# EAGLE schematic Schematic (EAGLE 7.3.0)
Datalogger with OneWire port and 6 anaog ports on flat connector.
CNAME: Per Abich / Visma Consulting AS
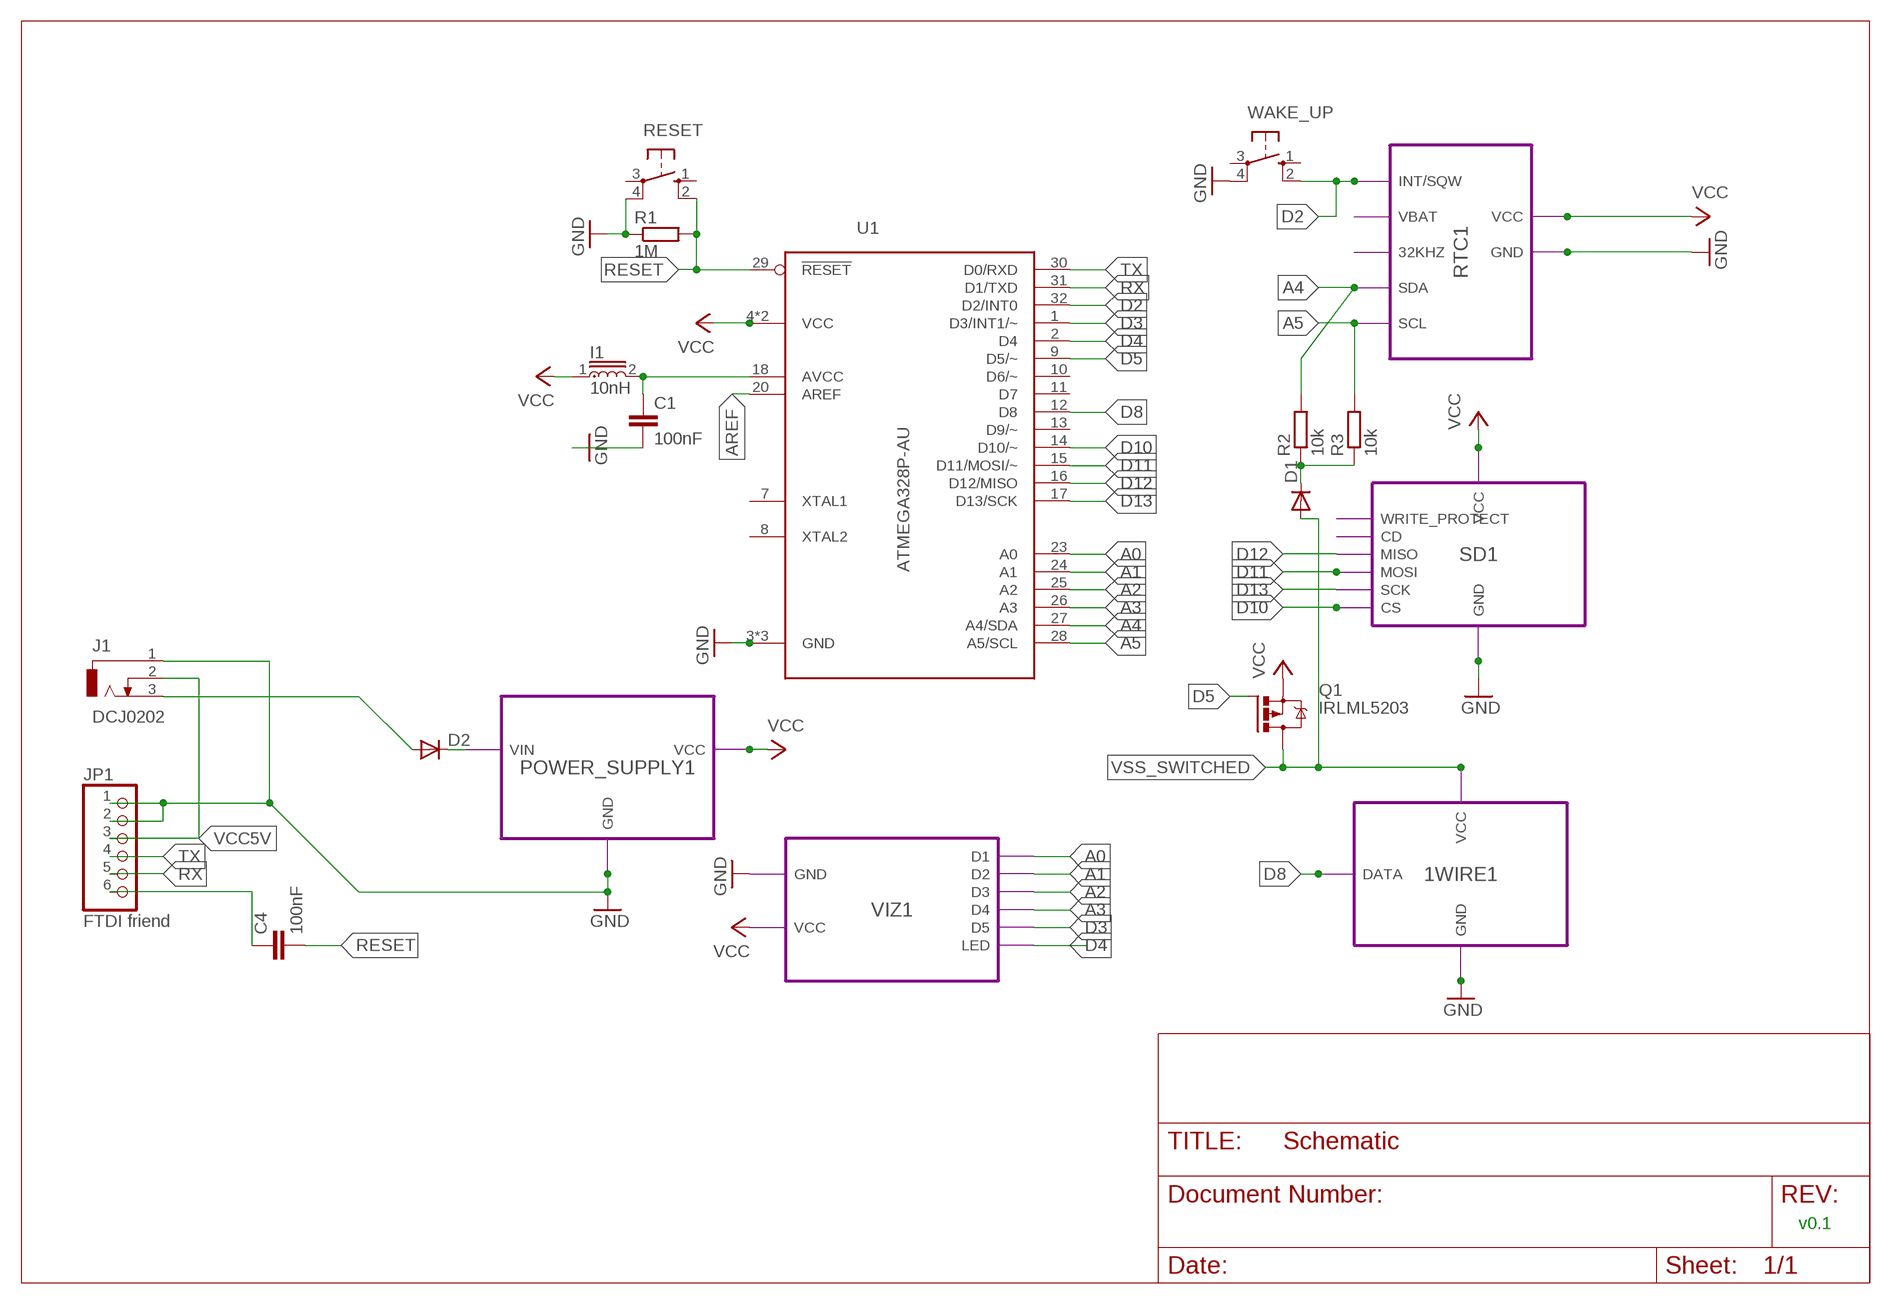
[diagram p0: schematic, sheet 1]

## Parts
C1  100nF  C-EUC1206  [C1206]
C4  100nF  C-EUC1206  [C1206]
D1  DIODE-DO214AA  [DO214AA]
D2  DIODE-DO214AA  [DO214AA]
I1  10nH  MLF1608E  [L3225M]
J1  DCJ0202  [DCJ0202]
JP1  FTDI friend  PINHD-1X6/90  [1X06/90]
Q1  IRLML5203  [MICRO3]
R1  1M  R-EU_R1206  [R1206]
R2  10k  R-EU_R1206  [R1206]
R3  10k  R-EU_R1206  [R1206]
RESET  10-XX  [B3F-10XX]
U1  ATMEGA328P-AU  [TQFP32-08]
WAKE_UP  10-XX  [B3F-10XX]

## Module instances
POWER_SUPPLY1 = POWER_SUPPLY
RTC1 = RTC
SD1 = SDCARD
1WIRE1 = ONE_WIRE
VIZ1 = VISIBILITY_SENSOR

## Nets
A0: U1.23(A0) ; port VIZ1.D1
A1: U1.24(A1) ; port VIZ1.D2
A2: U1.25(A2) ; port VIZ1.D3
A3: U1.26(A3) ; port VIZ1.D4
A4: R2.2 U1.27(A4/SDA) ; port RTC1.SDA
A5: R3.2 U1.28(A5/SCL) ; port RTC1.SCL
AREF: U1.20(AREF)
AVCC: C1.1 I1.2 U1.18(AVCC)
D2: U1.32(D2/INT0) WAKE_UP.2(S1) ; port RTC1.INT/SQW
D3: U1.1(D3/INT1/~) ; port VIZ1.D5
D4: U1.2(D4) ; port VIZ1.LED
D5: Q1.1(G) U1.9(D5/~)
D8: U1.12(D8) ; port 1WIRE1.DATA
D10: U1.14(D10/~) ; port SD1.CS
D11: U1.15(D11/MOSI/~) ; port SD1.MOSI
D12: U1.16(D12/MISO) ; port SD1.MISO
D13: U1.17(D13/SCK) ; port SD1.SCK
DTR: C4.1 JP1.6
GND: C1.2 J1.1 JP1.1 JP1.2 R1.1 RESET.4(P1) U1.3(GND) U1.5(GND) U1.21(GND) WAKE_UP.4(P1) ; port POWER_SUPPLY1.GND RTC1.GND SD1.GND 1WIRE1.GND VIZ1.GND
N$1: D2.A J1.3
N$2: D2.C ; port POWER_SUPPLY1.VIN
N$17: D1.C R2.1 R3.1
RESET: C4.2 R1.2 RESET.2(S1) U1.29(!RESET)
RX: JP1.5 U1.31(D1/TXD)
TX: JP1.4 U1.30(D0/RXD)
VCC: I1.1 Q1.2(S) U1.4(VCC) U1.6(VCC) ; port POWER_SUPPLY1.VCC RTC1.VCC SD1.VCC VIZ1.VCC
VCC5V: J1.2 JP1.3
VSS_SWITCHED: D1.A Q1.3(D) ; port 1WIRE1.VCC
Unconnected: RESET.1(S) RESET.3(P) U1.7(XTAL1) U1.8(XTAL2) U1.10(D6/~) U1.11(D7) U1.13(D9/~) WAKE_UP.1(S) WAKE_UP.3(P)

## Notes on the sheet
- v0.1

## Library data of the parts
C1 C4 = rcl:C-EU: CAPACITOR, European symbol; MF: AVX; MPN: 02016D104KAT2A; OC_FARNELL: 2280755
D1 D2 = diode:DIODE-: DIODE; OC_FARNELL: unknown
I1 = Element14Parts:MLF1608E; MF: TDK; MPN: NLCV32T-100K-PFR; OC_FARNELL: 2112810
J1 = con-jack:DCJ0202: DC POWER JACK Source: DCJ0202.pdf; OC_FARNELL: unknown; OC_NEWARK: unknown
JP1 = pinhead:PINHD-1X6: PIN HEADER; OC_FARNELL: unknown; VV: v,,v
Q1 = transistor-power:IRLML5203: HEXFET P-Channel Power MOSFET; MF: FAIRCHILD SEMICONDUCTOR; MPN: FDN360P; OC_FARNELL: 9846336
R1 = rcl:R-EU_: RESISTOR, European symbol; MF: VISHAY DRALORIC; MPN: CRCW12061M00FKEA; OC_FARNELL: 1469968
R2 R3 = rcl:R-EU_: RESISTOR, European symbol; MF: VISHAY DRALORIC; MPN: CRCW120610K0FKTA; OC_FARNELL: 1653050
RESET WAKE_UP = switch-omron:10-XX: OMRON SWITCH; MF: OMRON ELECTRONIC COMPONENTS; MPN: B3F-1000; OC_FARNELL: 176432; OC_NEWARK: 36M3542
U1 = Arduino Dev Parts:ATMEGA328P: Atmel ATmega328P; MPN: ATMEGA328P-AU; OC_FARNELL: 1715486; OC_NEWARK: 68T2935

## Module POWER_SUPPLY
Ports: VCC(io) VIN(io) GND(io)
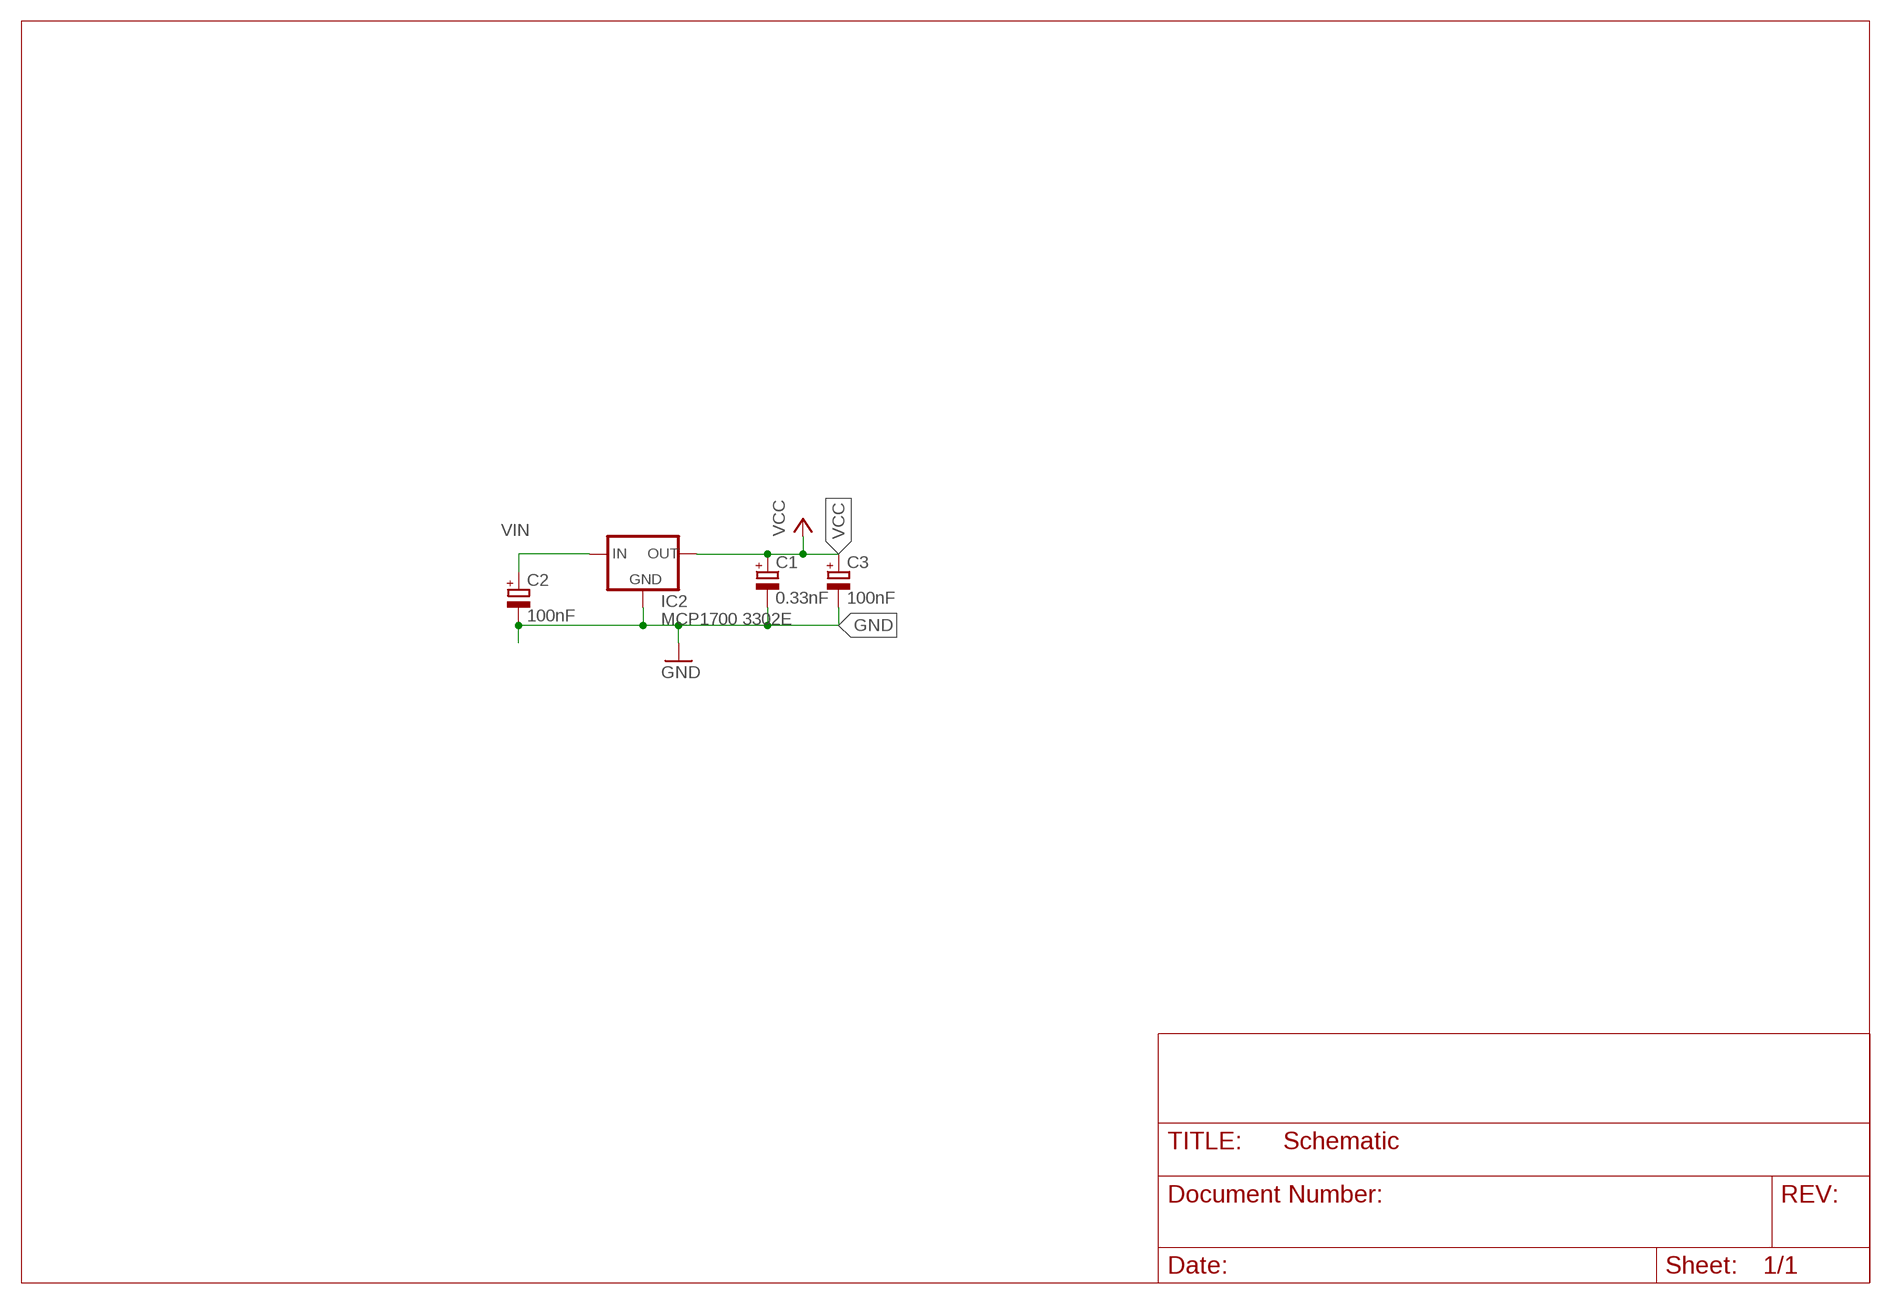
[diagram p1: schematic, module POWER_SUPPLY, sheet 1]

### Parts
C1  0.33nF  CPOL-EUSMCB  [SMC_B]
C2  100nF  CPOL-EUSMCB  [SMC_B]
C3  100nF  CPOL-EUSMCB  [SMC_B]
IC2  MCP1700 3302E  MCP1700INLINE  [TO92-INLINE]

### Nets
GND: C1.- C2.- C3.- IC2.1(GND)
VCC: C1.+ C3.+ IC2.3(OUT)
VIN: C2.+ IC2.2(IN)

### Library data of the parts
C1 = rcl:CPOL-EU: POLARIZED CAPACITOR, European symbol; MF: AVX; MPN: 0201YC331KAT2A; OC_FARNELL: 1327618RL
C2 C3 = rcl:CPOL-EU: POLARIZED CAPACITOR, European symbol; MF: AVX; MPN: 02016D104KAT2A; OC_FARNELL: 2280755
IC2 = adafruit:MCP1700: VOLTAGE REGULATOR; MF: MICROCHIP; MPN: MCP1700-3302E/TO; OC_FARNELL: 1296588

## Module RTC
Ports: GND(io) VCC(io) SCL(io) SDA(io) 32KHZ(io) INT/SQW(io) VBAT(io)
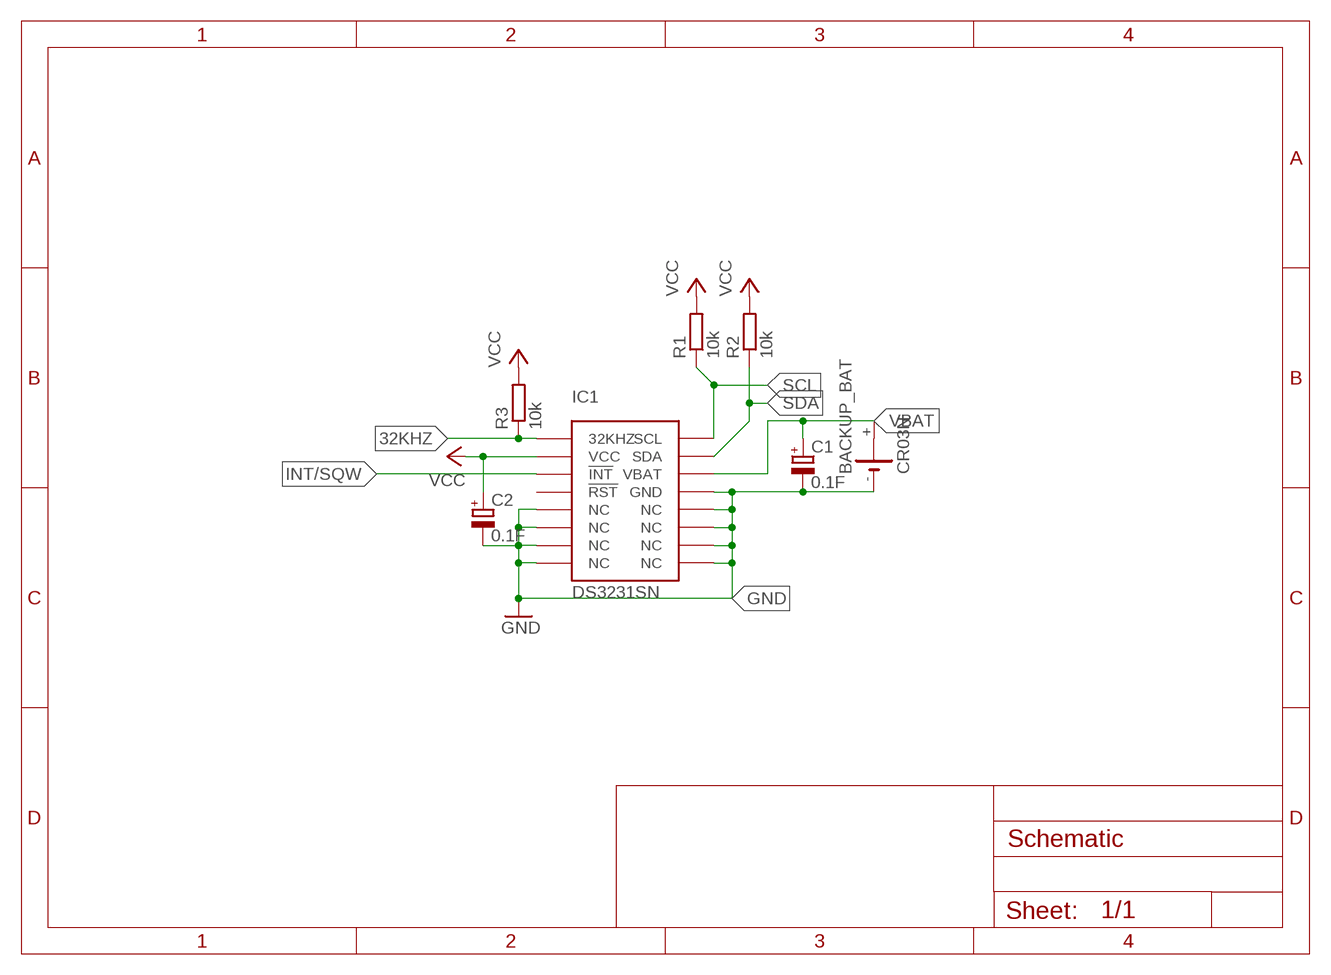
[diagram p2: schematic, module RTC, sheet 1]

### Parts
BACKUP_BAT  CR03N  [CR03N]
C1  0.1F  CPOL-EUSMCB  [SMC_B]
C2  0.1F  CPOL-EUSMCB  [SMC_B]
IC1  DS3231SN  DS3231SOIC-16W  [SOIC-16W]
R1  10k  R-EU_R1206  [R1206]
R2  10k  R-EU_R1206  [R1206]
R3  10k  R-EU_R1206  [R1206]

### Nets
32KHZ: IC1.1(32KHZ) R3.1
GND: BACKUP_BAT.- C1.- C2.- IC1.5(NC) IC1.6(NC) IC1.7(NC) IC1.8(NC) IC1.9(NC) IC1.10(NC) IC1.11(NC) IC1.12(NC) IC1.13(GND)
INT/SQW: IC1.3(!INT)
SCL: IC1.16(SCL) R1.1
SDA: IC1.15(SDA) R2.1
VBAT: BACKUP_BAT.+ C1.+ IC1.14(VBAT)
VCC: C2.+ IC1.2(VCC) R1.2 R2.2 R3.2
Unconnected: BACKUP_BAT.+@1(+) IC1.4(!RST)

### Library data of the parts
BACKUP_BAT = battery:CR03N: LI BATTERY Sonnenschein; OC_FARNELL: unknown
C1 C2 = rcl:CPOL-EU: POLARIZED CAPACITOR, European symbol; MF: AVX; MPN: TAJB107K004RNJ; OC_FARNELL: 196988
IC1 = DS3231_industrialberry:DS3231; MF: MAXIM INTEGRATED PRODUCTS; MPN: DS3231SN#; OC_FARNELL: 1593292
R1-R3 = rcl:R-EU_: RESISTOR, European symbol; MF: VISHAY DRALORIC; MPN: CRCW120610K0FKTA; OC_FARNELL: 1653050

## Module SDCARD
Ports: VCC(io) GND(io) WRITE_PROTECT(io) CD(io) MISO(io) MOSI(io) SCK(io) CS(io)
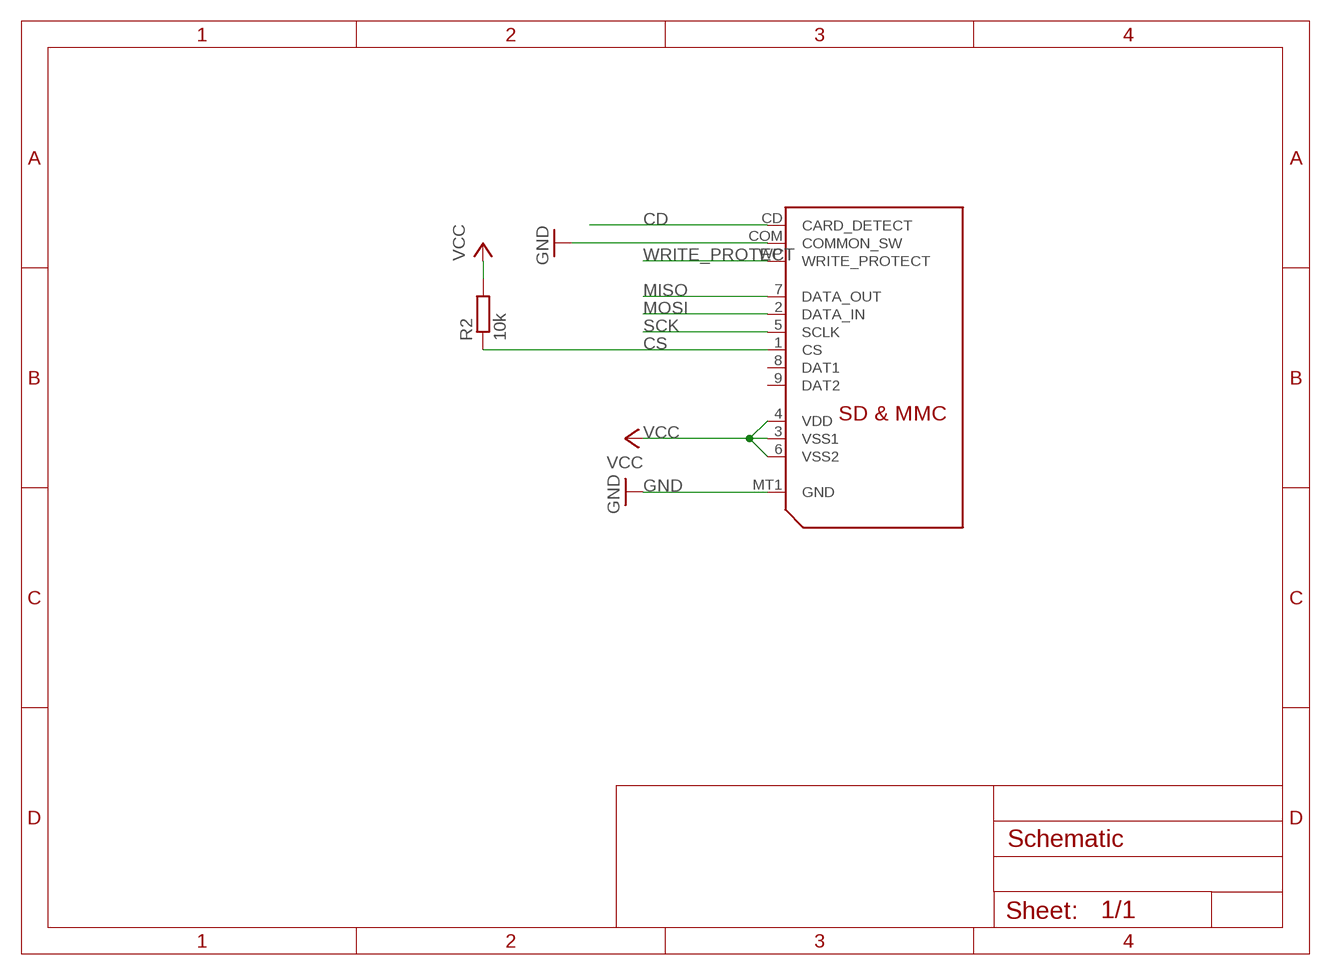
[diagram p3: schematic, module SDCARD, sheet 1]

### Parts
R2  10k  R-EU_R1206  [R1206]
U$1  SDMMC18650  [SDCARD]

### Nets
CD: U$1.CD(CARD_DETECT)
CS: R2.1 U$1.1(CS)
GND: U$1.COM(COMMON_SW) U$1.MT1(GND)
MISO: U$1.7(DATA_OUT)
MOSI: U$1.2(DATA_IN)
SCK: U$1.5(SCLK)
VCC: R2.2 U$1.3(VSS1) U$1.4(VDD) U$1.6(VSS2)
WRITE_PROTECT: U$1.WP(WRITE_PROTECT)
Unconnected: U$1.8(DAT1) U$1.9(DAT2)

### Library data of the parts
R2 = rcl:R-EU_: RESISTOR, European symbol; MF: VISHAY DRALORIC; MPN: CRCW120610K0FKTA; OC_FARNELL: 1653050
U$1 = adafruit:SDMMC: SD MMC Card holder 4UCON part #06132 - easy to solder; MF: AMPHENOL COMMERCIAL PRODUCTS; MPN: 101-00565-64; OC_FARNELL: 2135992

## Module ONE_WIRE
Ports: VCC(io) DATA(io) GND(io)
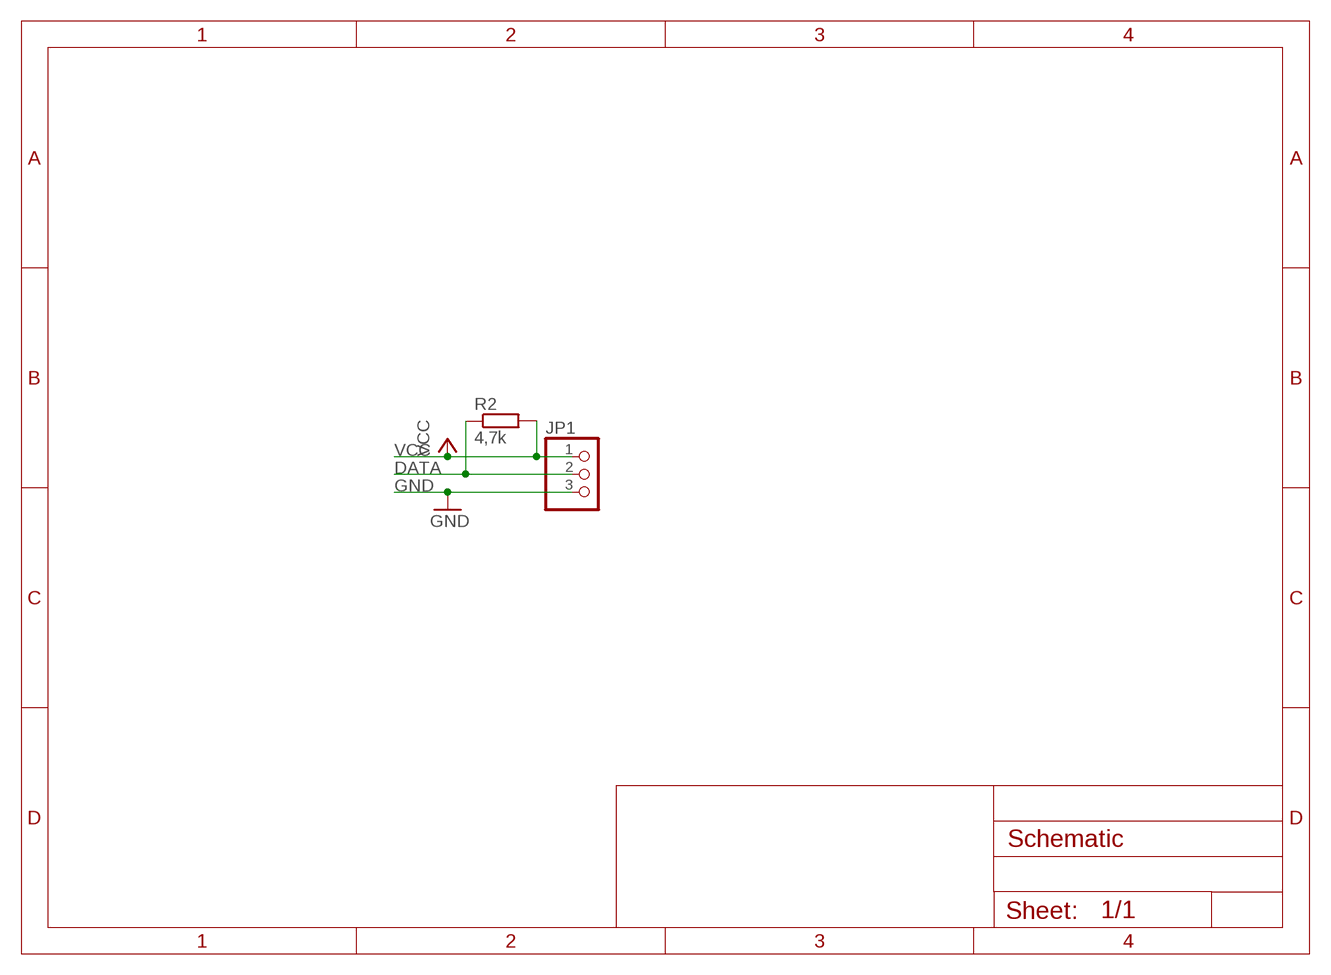
[diagram p4: schematic, module ONE_WIRE, sheet 1]

### Parts
JP1  PINHD-1X3/90  [1X03/90]
R2  4,7k  R-EU_R1206  [R1206]

### Nets
DATA: JP1.2 R2.1
GND: JP1.3
VCC: JP1.1 R2.2

### Library data of the parts
JP1 = pinhead:PINHD-1X3: PIN HEADER; MF: TE CONNECTIVITY / AMP; MPN: 292253-3; OC_FARNELL: 1282936
R2 = resistor:R-EU_: RESISTOR, European symbol; MF: PANASONIC ELECTRONIC COMPONENTS; MPN: ERJB1AF472U; OC_FARNELL: 2293982RL

## Module VISIBILITY_SENSOR
Ports: GND(io) VCC(io) D1(io) D2(io) D3(io) D4(io) D5(io) LED(io)
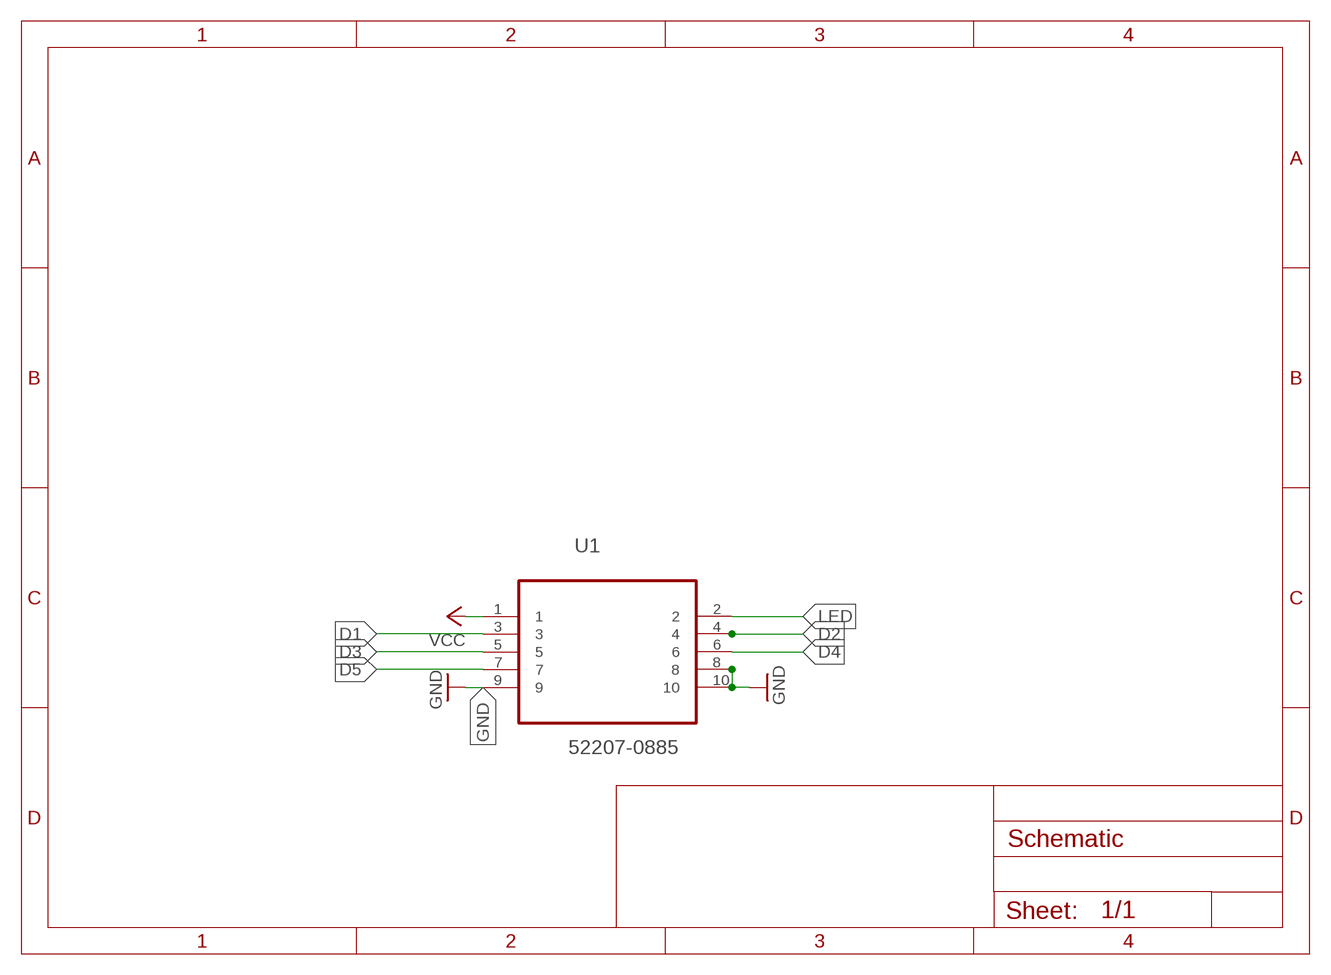
[diagram p5: schematic, module VISIBILITY_SENSOR, sheet 1]

### Parts
U1  52207-0885  [MOLEX_52207-0885]

### Nets
D1: U1.3
D2: U1.4
D3: U1.5
D4: U1.6
D5: U1.7
GND: U1.8 U1.9 U1.10
LED: U1.2
VCC: U1.1

### Library data of the parts
U1 = Molex_By_element14_Batch_1:52207-0885: SOCKET FPC, SMT, 1MM, 8 WAY; OC_FARNELL: unknown; OC_NEWARK: 07P8553; PACKAGE: SOCKET FPC, SMT, 1MM, 8 WAY; SUPPLIER: Molex